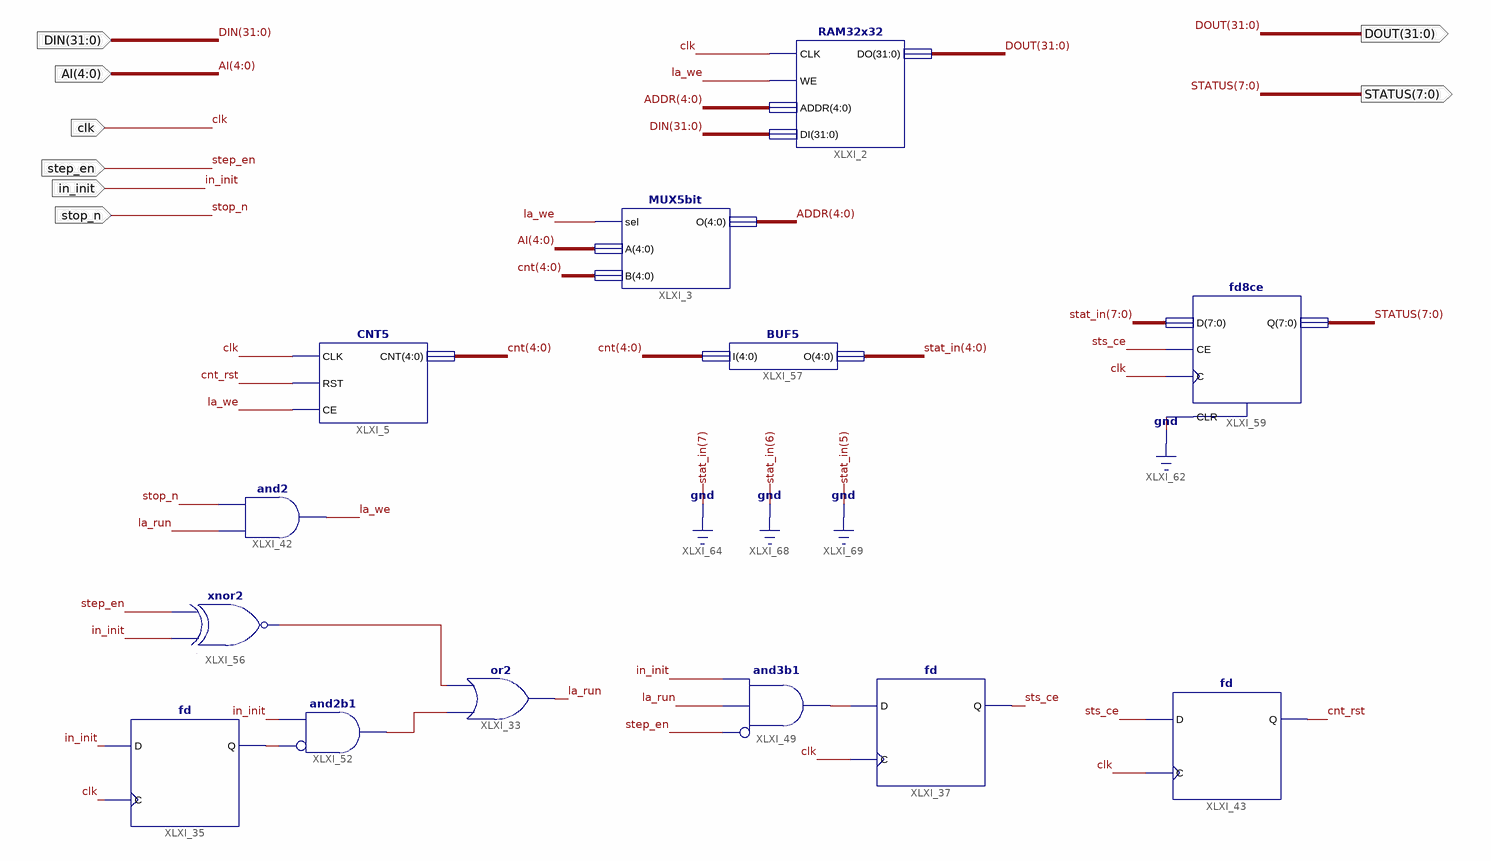
[diagram p0: schematic sheet 1]
// Xilinx ISE schematic Logic_Analizer.sch (spartan6) as structural Verilog: 13 symbols, 8 ports
module Logic_Analizer (
  input  [4:0] AI,
  input  clk,
  input  [31:0] DIN,
  input  step_en,
  input  in_init,
  input  stop_n,
  output [31:0] DOUT,
  output [7:0] STATUS
);

  wire cnt_rst, la_run, la_we, sts_ce, XLXN_100, XLXN_136, XLXN_146, XLXN_147;
  wire [4:0] ADDR, cnt, stat_in;

  MUX5bit XLXI_3 (.sel(la_we), .A(AI), .B(cnt), .O(ADDR));
  or XLXI_33 (la_run, XLXN_147, XLXN_100);
  and XLXI_42 (la_we, la_run, stop_n);
  fd XLXI_37 (.C(clk), .D(XLXN_136), .Q(sts_ce));
  fd XLXI_43 (.C(clk), .D(sts_ce), .Q(cnt_rst));
  and XLXI_49 (XLXN_136, ~step_en, la_run, in_init);  // and3b1
  and XLXI_52 (XLXN_147, ~XLXN_146, in_init);  // and2b1
  fd XLXI_35 (.C(clk), .D(in_init), .Q(XLXN_146));
  xnor XLXI_56 (XLXN_100, in_init, step_en);
  fd8ce XLXI_59 (.C(clk), .CE(sts_ce), .CLR(1'b0), .D({3'b000, stat_in}), .Q(STATUS));
  BUF5 XLXI_57 (.I(cnt), .O(stat_in));
  RAM32x32 XLXI_2 (.CLK(clk), .WE(la_we), .ADDR(ADDR), .DI(DIN), .DO(DOUT));
  CNT5 XLXI_5 (.CLK(clk), .RST(cnt_rst), .CE(la_we), .CNT(cnt));
endmodule
